# EAGLE design exp (EAGLE 5.06)
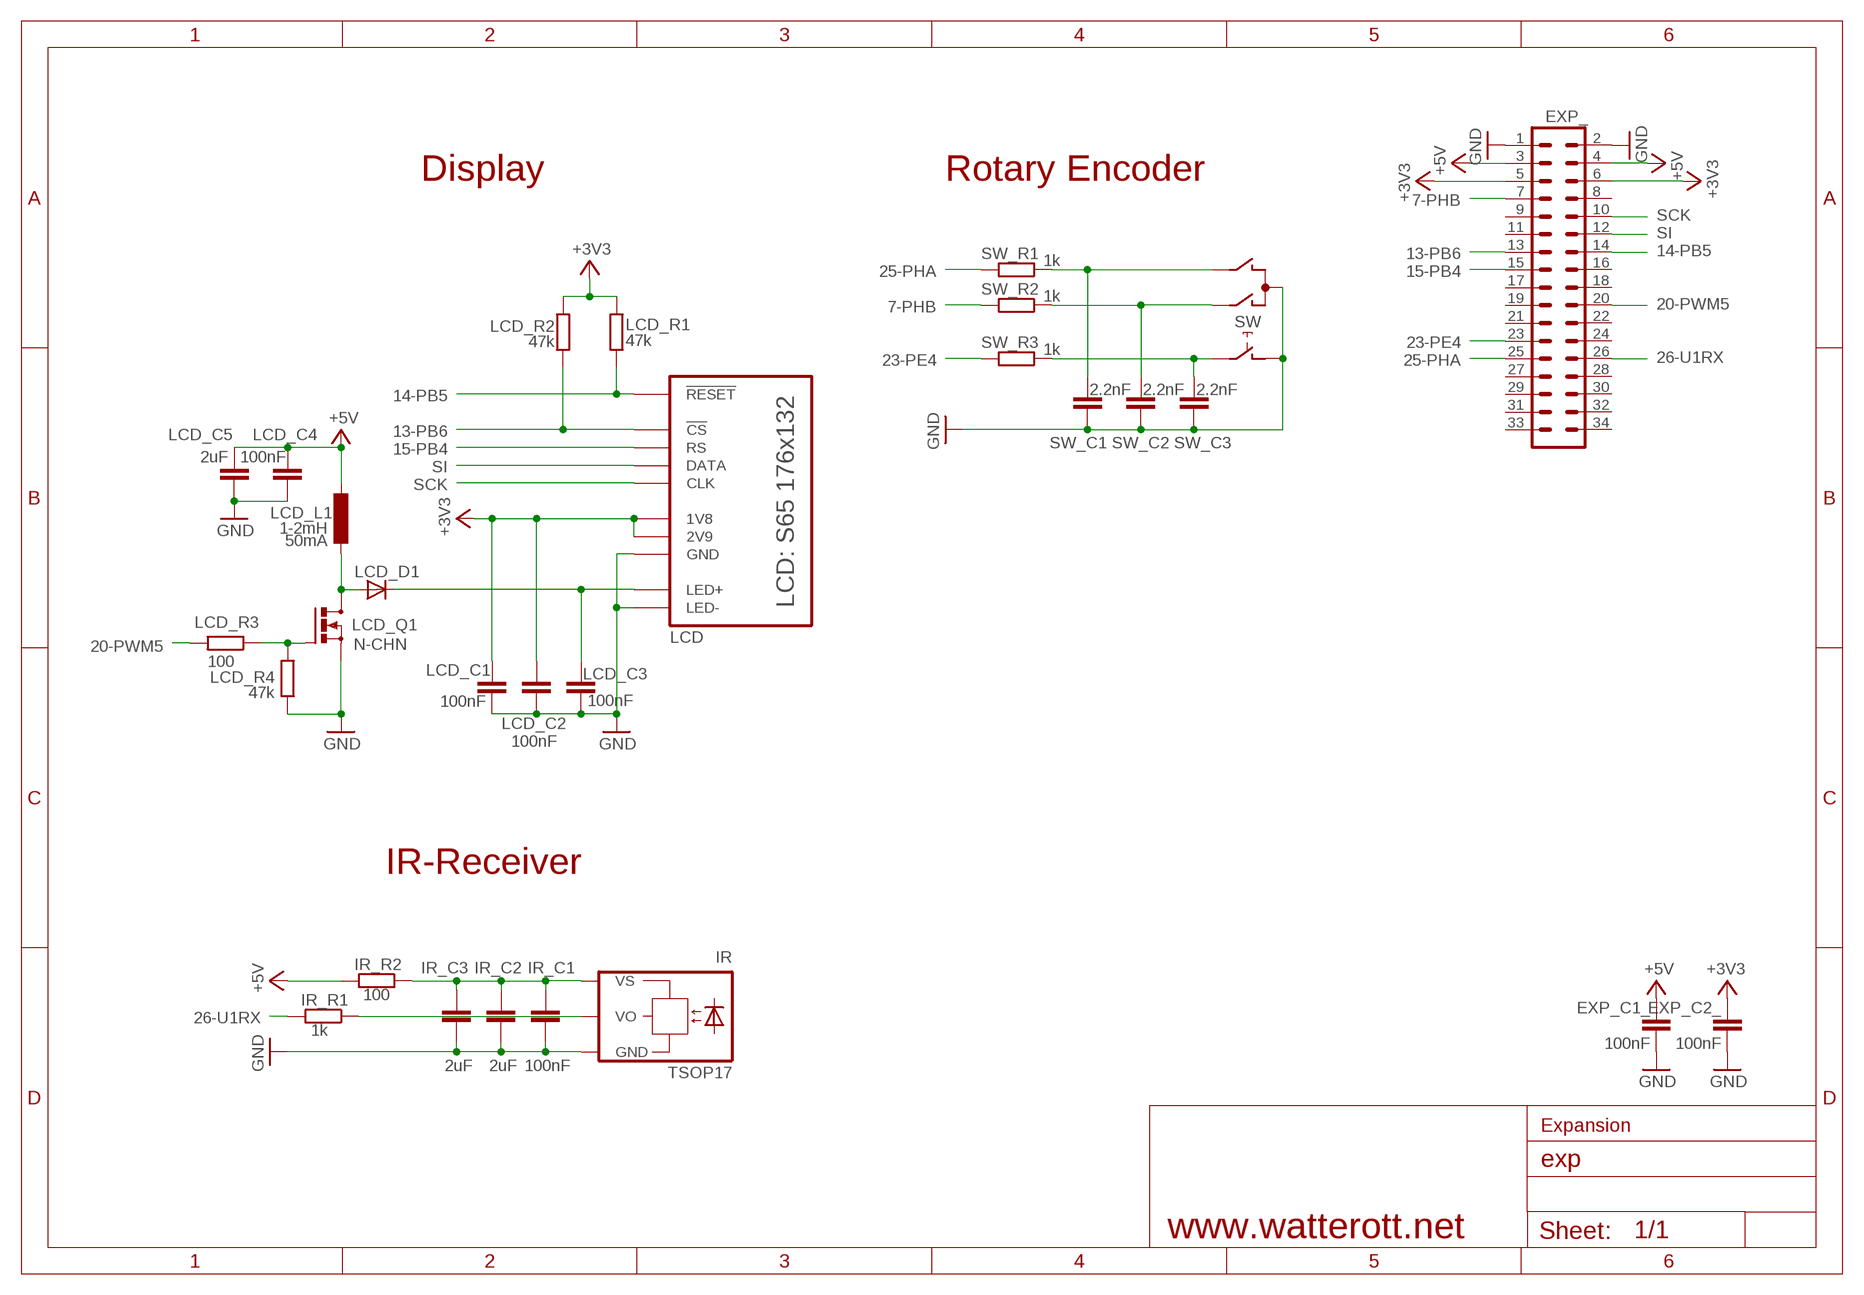
[diagram p0: schematic, sheet 1]

## Parts
EXP_  MA17-2  [MA17-2]
EXP_C1_  100nF  C-EUC0603  [C0603]
EXP_C2_  100nF  C-EUC0603  [C0603]
IR  TSOP17  [TSOP17]
IR_C1  100nF  C-EUC0603  [C0603]
IR_C2  2uF  C-EUC0603K  [C0603K]
IR_C3  2uF  C-EUC0603K  [C0603K]
IR_R1  1k  R-EU_R0603  [R0603]
IR_R2  100  R-EU_R0603  [R0603]
LCD  S65  [S65]
LCD_C1  100nF  C-EUC0603  [C0603]
LCD_C2  100nF  C-EUC0603  [C0603]
LCD_C3  100nF  C-EUC0603  [C0603]
LCD_C4  100nF  C-EUC0603  [C0603]
LCD_C5  2uF  C-EUC0603K  [C0603K]
LCD_D1  DIODE-DO214AA  [DO214AA]
LCD_L1  1-2mH  L-EUL4532C  [L4532M]
LCD_Q1  N-CHN  IRLML2502  [MICRO3]
LCD_R1  47k  R-EU_R0603  [R0603]
LCD_R2  47k  R-EU_R0603  [R0603]
LCD_R3  100  R-EU_R0603  [R0603]
LCD_R4  47k  R-EU_R0603  [R0603]
SW  EC12E_SW  [ALPS_EC12E_SW]
SW_C1  2.2nF  C-EUC0603  [C0603]
SW_C2  2.2nF  C-EUC0603  [C0603]
SW_C3  2.2nF  C-EUC0603  [C0603]
SW_R1  1k  R-EU_R0603  [R0603]
SW_R2  1k  R-EU_R0603  [R0603]
SW_R3  1k  R-EU_R0603  [R0603]

## Nets
7-PHB: EXP_.7 SW_R2.2
13-PB6: EXP_.13 LCD.CS(!CS) LCD_R2.2
14-PB5: EXP_.14 LCD.RESET(!RESET) LCD_R1.2
15-PB4: EXP_.15 LCD.RS
20-PWM5: EXP_.20 LCD_R3.2
23-PE4: EXP_.23 SW_R3.2
25-PHA: EXP_.25 SW_R1.2
26-U1RX: EXP_.26 IR_R1.2
+3V3: EXP_.5 EXP_.6 EXP_C2_.1 LCD.1V8 LCD.2V9 LCD_C1.1 LCD_C2.1 LCD_R1.1 LCD_R2.1
+5V: EXP_.3 EXP_.4 EXP_C1_.1 IR_R2.2 LCD_C4.1 LCD_C5.1 LCD_L1.2
B: LCD_Q1.1(G) LCD_R3.1 LCD_R4.2
E: LCD_D1.A LCD_L1.1 LCD_Q1.3(D)
GND: EXP_.1 EXP_.2 EXP_C1_.2 EXP_C2_.2 IR.GND IR_C1.2 IR_C2.2 IR_C3.2 LCD.GND LCD.LED- LCD_C1.2 LCD_C2.2 LCD_C3.2 LCD_C4.2 LCD_C5.2 LCD_Q1.2(S) LCD_R4.1 SW.C SW.D SW_C1.1 SW_C2.1 SW_C3.1
LED+: LCD.LED+ LCD_C3.1 LCD_D1.C
N$1: SW.B SW_C1.2 SW_R1.1
N$3: SW.A SW_C2.2 SW_R2.1
N$4: SW.E SW_C3.2 SW_R3.1
SCK: EXP_.10 LCD.CLK
SI: EXP_.12 LCD.DATA
VO: IR.VO IR_R1.1
VS: IR.VS IR_C1.1 IR_C2.1 IR_C3.1 IR_R2.1
Unconnected: EXP_.8 EXP_.9 EXP_.11 EXP_.16 EXP_.17 EXP_.18 EXP_.19 EXP_.21 EXP_.22 EXP_.24 EXP_.27 EXP_.28 EXP_.29 EXP_.30 EXP_.31 EXP_.32 EXP_.33 EXP_.34 SW.GND1(G) SW.GND2(G)

## Notes on the sheet
- Display | Rotary Encoder
- 50mA
- IR-Receiver
- Expansion
- www.watterott.net

## Library data of the parts
EXP_ = con-lstb:MA17-2: PIN HEADER
EXP_C1_ EXP_C2_ IR_C1-IR_C3 LCD_C1-LCD_C5 SW_C1-SW_C3 = rcl:C-EU: CAPACITOR, European symbol
IR = Encoder-IR:TSOP17
IR_R1 IR_R2 LCD_R1-LCD_R4 SW_R1-SW_R3 = rcl:R-EU_: RESISTOR, European symbol
LCD = Display:S65: Siemens S65 Display 176x132 16bit
LCD_D1 = diode:DIODE-: DIODE
LCD_L1 = rcl:L-EU: INDUCTOR, European symbol
LCD_Q1 = IRF-sot23:IRLML2502: N-Channel Power MOSFET
SW = Encoder-IR:EC12E_SW: ALPS EC12E Rotary Encoder with switch

## Board
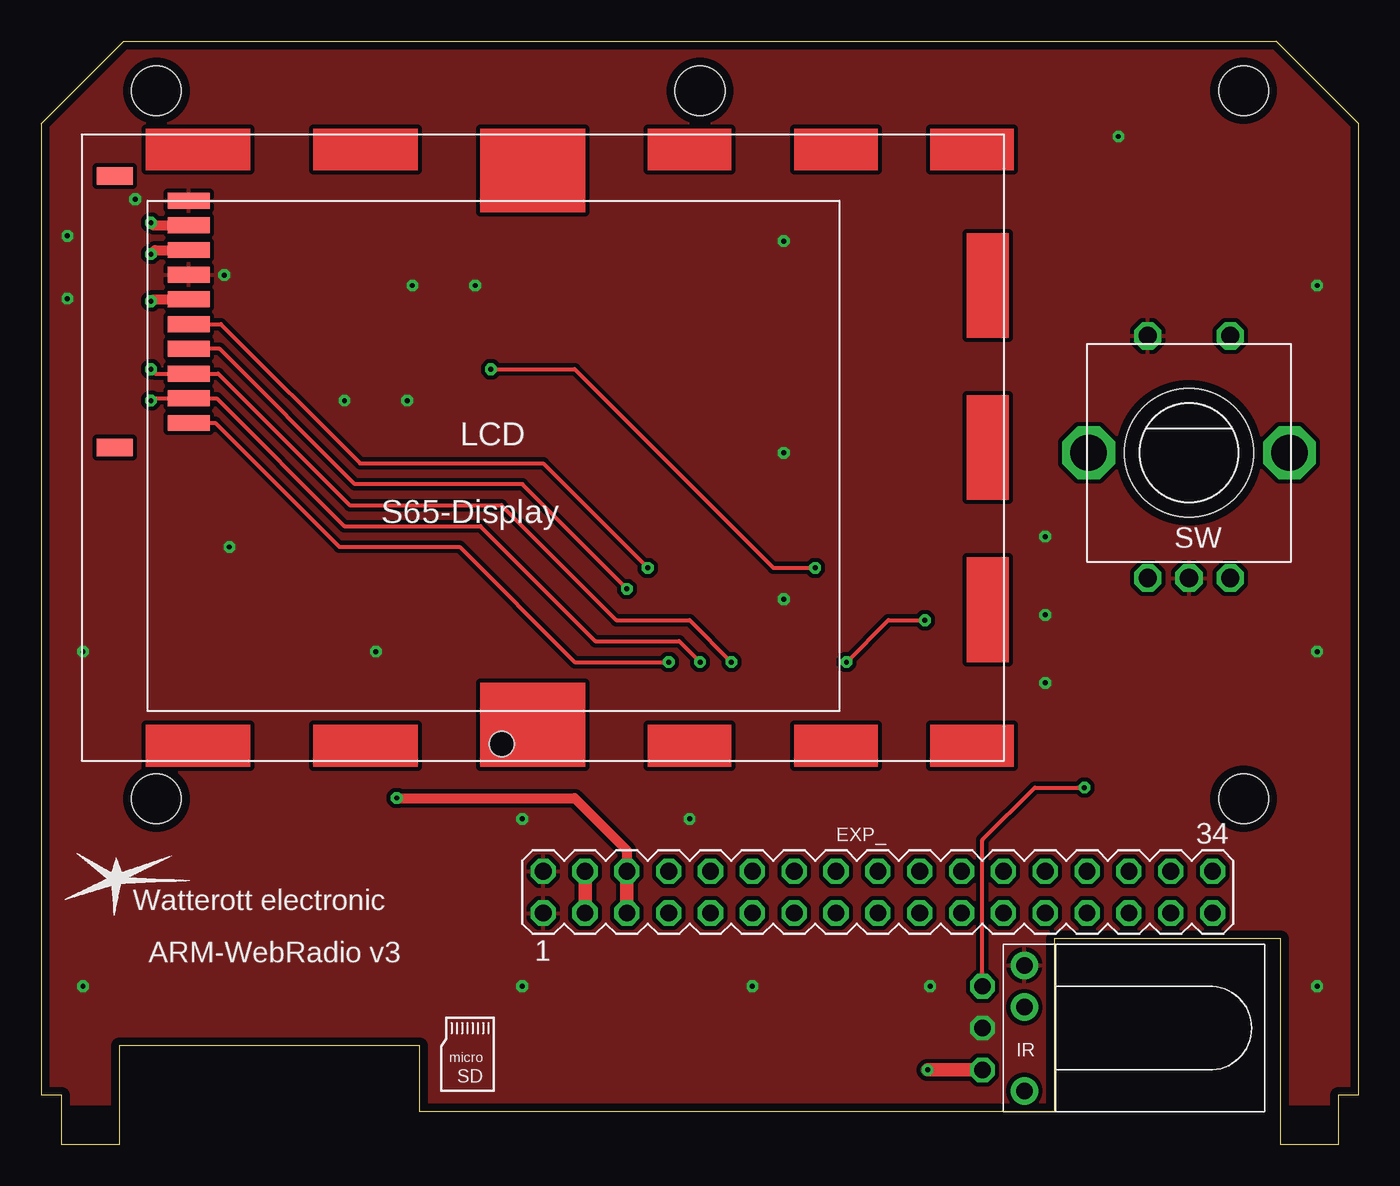
[diagram p1: board, top side]
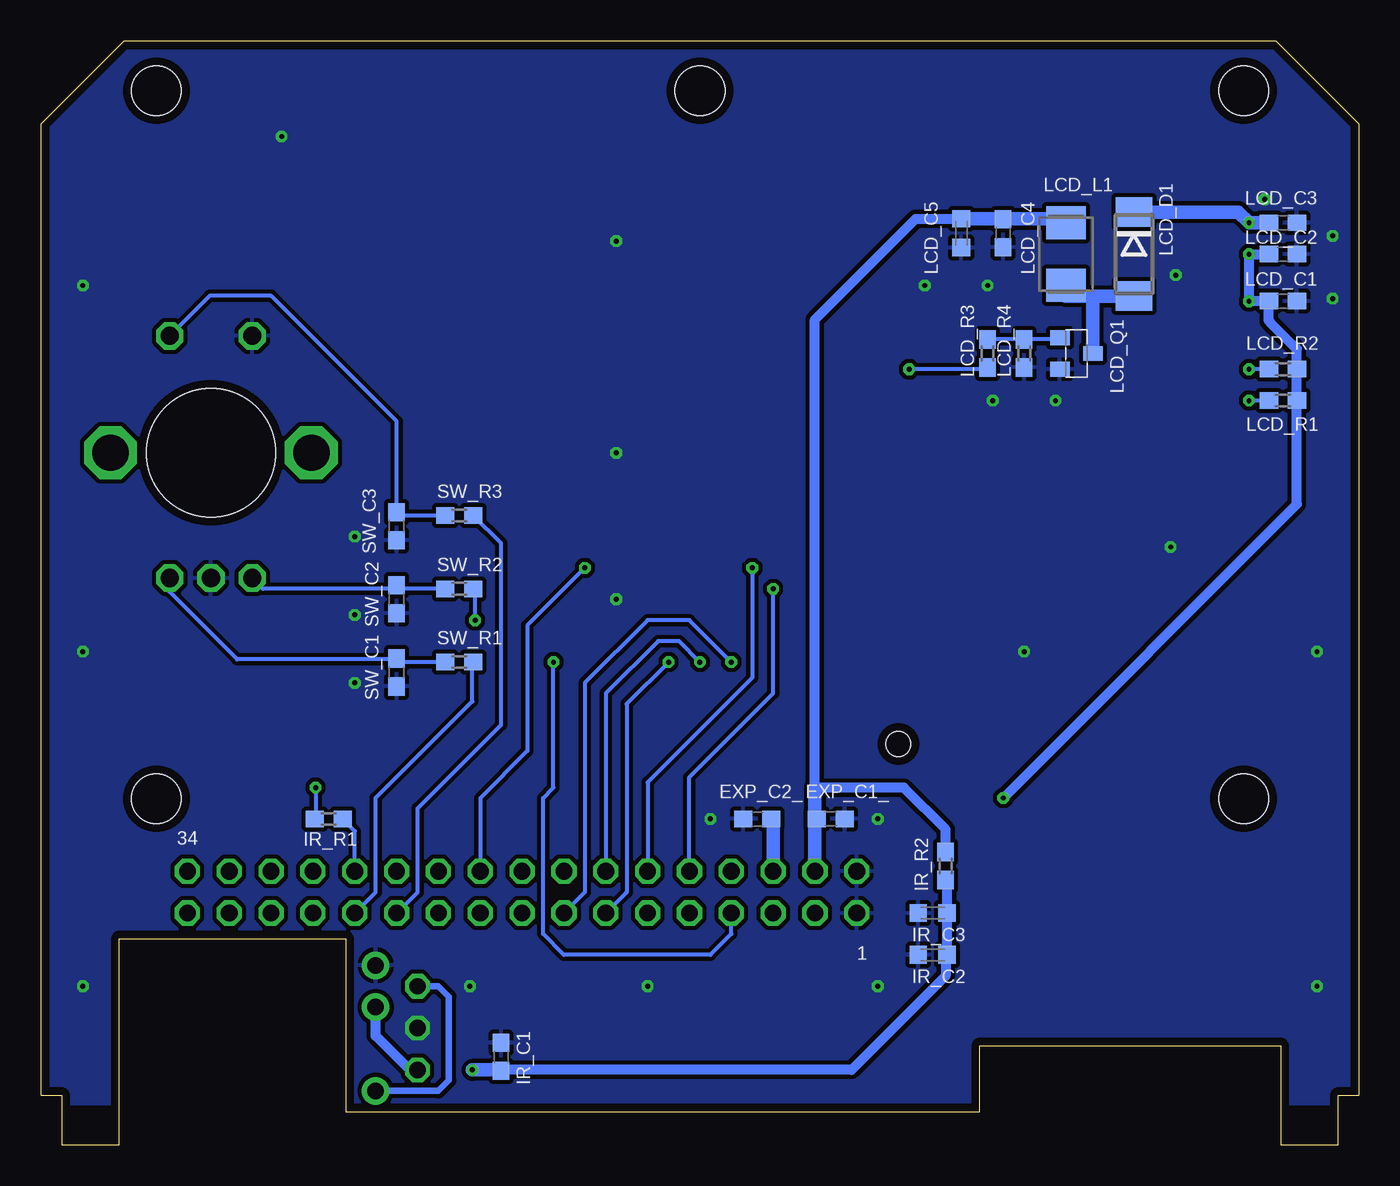
[diagram p2: board, bottom side, seen from below]

Size 80 x 67 mm. Coordinates in mm from the lower left corner, seen from the top.
Outline: 80,3 80,62 75,67 5,67 0,62 0,3 1.25,3 1.25,0 4.75,0 4.75,6 23,6 23,2 61.5,2 61.5,12.5 75.25,12.5 75.25,0 78.75,0 78.75,3 80,3
Copper layers (1*16): Top 0.035mm / dielectric 1.5mm / Bottom 0.035mm
Design rules "default *": minimum track width 7mil, minimum drill 0.3mm, track to track 7mil, track to pad 7mil, pad to pad 7mil, via to via 7mil, smd to smd 7mil, copper to edge 20mil, drill to drill 8mil, minimum pad ring 10mil, minimum via ring 8mil, stop-mask expansion 4mil, vias tented up to drill 0.5mm, thermal gap 10mil
Holes 3 mm at 7,64 40,64 7,21 73,64 73,21
Holes 7.8 mm at 69.69,42.01

### Footprints (pad centres in the part's own frame; a part is rotated, then mirrored left to right if it is on the bottom)
MA17-2 = drill 1.016 octagon: 1 -20.32,-1.27; 2 -20.32,1.27; 3 -17.78,-1.27; 4 -17.78,1.27; 5 -15.24,-1.27; 6 -15.24,1.27; 7 -12.7,-1.27; 8 -12.7,1.27; 9 -10.16,-1.27; 10 -10.16,1.27; 11 -7.62,-1.27; 12 -7.62,1.27; 13 -5.08,-1.27; 14 -5.08,1.27; 15 -2.54,-1.27; 16 -2.54,1.27; 17 0,-1.27; 18 0,1.27; 19 2.54,-1.27; 20 2.54,1.27; 21 5.08,-1.27; 22 5.08,1.27; 23 7.62,-1.27; 24 7.62,1.27; 25 10.16,-1.27; 26 10.16,1.27; 27 12.7,-1.27; 28 12.7,1.27; 29 15.24,-1.27; 30 15.24,1.27; 31 17.78,-1.27; 32 17.78,1.27; 33 20.32,-1.27; 34 20.32,1.27
C0603 = smd 1.1 x 1: 1 -0.85,0; 2 0.85,0
TSOP17 = drill 1 pad 1.676 round: GND 0,3.81; VO 0,-3.81; VS 0,1.27
C0603K = smd 1.05 x 1.08: 1 -0.875,0; 2 0.875,0
R0603 = smd 1.1 x 1: 1 -0.85,0; 2 0.85,0
S65 = smd 2.54 x 0.965: 1V8 6.5,31; 2V9 6.5,28; CLK 6.5,25; CS 6.5,23.5; DATA 6.5,26.5; GND 6.5,29.5; LED+ 6.5,32.5; LED- 6.5,34; RESET 6.5,22; RS 6.5,20.5 | smd 2.184 x 1.067: NC1 2,19; NC2 2,35.5 | hole 1.5: 25.5,1
DO214AA = smd 1.8 x 2.2: A 2.55,0; C -2.55,0
L4532M = smd 2 x 2.4: 1 -1.9,0; 2 1.9,0
MICRO3 = smd 0.9 x 1.2: 1 -0.95,-1; 2 0.95,-1; 3 0,1
ALPS_EC12E_SW = drill 1.1 octagon: A -2.5,-7.6; B 2.5,-7.6; C 0,-7.6; D -2.5,7.1; E 2.5,7.1 | drill 2.2 octagon: GND1 -6.1,0; GND2 6.1,0

### Placement (x,y rotation side)
EXP_  50.8,15.34 0 top
EXP_C1_  32.07,19.78 0 bottom
EXP_C2_  36.51,19.78 180 bottom
IR  59.69,7.08 0 top
IR_C1  52.07,5.33 90 bottom
IR_C2  25.88,11.53 180 bottom
IR_C3  25.88,14.06 180 bottom
IR_R1  62.55,19.78 0 bottom
IR_R2  25.08,16.92 90 bottom
LCD  2.46,23.32 0 top
LCD_C1  4.6,51.21 0 bottom
LCD_C2  4.6,54.07 0 bottom
LCD_C3  4.6,55.98 0 bottom
LCD_C4  21.59,55.34 270 bottom
LCD_C5  24.13,55.34 270 bottom
LCD_D1  13.65,54.07 270 bottom
LCD_L1  17.78,54.07 90 bottom
LCD_Q1  17.14,48.04 270 bottom
LCD_R1  4.6,45.18 180 bottom
LCD_R2  4.6,47.09 180 bottom
LCD_R3  22.54,48.04 270 bottom
LCD_R4  20.32,48.04 90 bottom
SW  69.69,42.01 0 top
SW_C1  58.42,28.67 90 bottom
SW_C2  58.42,33.11 90 bottom
SW_C3  58.42,37.56 90 bottom
SW_R1  54.61,29.3 0 bottom
SW_R2  54.61,33.75 0 bottom
SW_R3  54.61,38.2 0 bottom

### Tracks (layer width: path | path; a pad name or v marks a point on that pad's centre or on a via)
7-PHB  (via drill 0.3)
  Top 0.254: v48.9,29.3 51.44,31.84 v53.66,31.84
  Bottom 0.254: SW_R2.2 53.66,33.75 v53.66,31.84 | EXP_.7 38.1,12.79 39.37,11.53 48.26,11.53 49.53,12.79 49.53,21.05 48.9,21.68 v48.9,29.3
13-PB6  (via drill 0.3)
  Top 0.254: v6.67,47.09 6.93,46.82 LCD.CS 10.74,46.82 18.73,38.83 27.94,38.83 34.92,31.84 39.37,31.84 v41.91,29.3
  Bottom 0.254: LCD_R2.2 v6.67,47.09 | EXP_.13 | EXP_.13 44.45,15.34 44.45,26.77 v41.91,29.3
14-PB5  (via drill 0.3)
  Top 0.254: v6.67,45.18 6.81,45.32 LCD.RESET 10.65,45.32 18.41,37.56 26.67,37.56 33.66,30.57 38.73,30.57 v40.01,29.3
  Bottom 0.254: LCD_R1.2 v6.67,45.18 | EXP_.14 45.72,27.4 42.55,30.57 41.27,30.57 v40.01,29.3
15-PB4  (via drill 0.3)
  Top 0.254: LCD.RS 10.57,43.82 18.1,36.29 25.4,36.29 32.38,29.3 v38.1,29.3
  Bottom 0.254: EXP_.15 | EXP_.15 46.99,15.34 46.99,28.04 43.18,31.84 40.64,31.84 v38.1,29.3
20-PWM5  (via drill 0.3)
  Top 0.254: v27.3,47.09 32.38,47.09 44.45,35.02 v46.99,35.02
  Bottom 0.254: v27.3,47.09 22.64,47.09 LCD_R3.2 | v46.99,35.02 50.48,31.53 50.48,23.91 53.34,21.05 EXP_.20
23-PE4
  Bottom 0.254: SW_R3.2 52.07,36.51 52.07,25.5 57.15,20.41 57.15,15.34 EXP_.23
25-PHA
  Bottom 0.254: SW_R1.2 53.82,29.25 53.82,26.92 59.69,21.05 59.69,15.34 EXP_.25
26-U1RX
  Bottom 0.254: EXP_.26 60.96,19.04 IR_R1.2
+3V3  (via drill 0.3)
  Top 0.61: LCD.1V8 6.92,54.32 v6.67,54.07 | v21.59,21.05 32.38,21.05 35.56,17.88 EXP_.6 | LCD.2V9 6.78,51.32 v6.67,51.21
  Top 0.813: EXP_.6 EXP_.5
  Bottom 0.406: 35.56,19.68 EXP_C2_.1 | LCD_R1.1 | 5.4,49.94 5.45,50 5.4,49.94
  Bottom 0.61: LCD_C2.1 v6.67,54.07 v6.67,51.21 LCD_C1.1 5.45,50 | 5.4,49.94 3.75,48.3 LCD_R2.1 LCD_R1.1 3.75,38.89 v21.59,21.05
  Bottom 0.813: EXP_.6 35.56,19.68
+5V
  Top 0.813: EXP_.4 EXP_.3
  Bottom 0.406: 33.02,19.78 EXP_C1_.1 | 21.27,56.22 21.59,56.22 LCD_C4.1
  Bottom 0.61: IR_R2.2 25.08,19.14 27.62,21.68 33.02,21.68 33.02,50.1 26.91,56.22 LCD_C5.1 | 17.78,56.22 LCD_L1.2 | EXP_C1_.1 33.02,19.68
  Bottom 0.813: 33.02,21.68 33.02,19.78 | 17.78,56.22 21.27,56.22 LCD_C5.1 | 33.02,19.68 EXP_.4
B
  Bottom 0.254: LCD_R3.1 LCD_R4.2 18.14,48.89 LCD_Q1.1
E
  Bottom 0.813: 16.14,51.52 LCD_D1.A | LCD_Q1.3 16.14,51.52 | 16.14,51.52 17.78,51.52 LCD_L1.1
GND  (via drill 0.3, 1)
  other vias: 18.41,45.18 22.23,45.18 11.11,52.8 22.54,52.16 57.15,7.08 39.37,19.78 29.21,19.78 60.96,36.92 60.96,32.16 60.96,28.04 1.59,55.18 1.59,51.37 26.35,52.16 65.41,61.21 11.43,36.29 29.21,9.62 53.98,9.62 2.54,9.62 2.54,29.94 77.47,52.16 77.47,29.94 77.47,9.62 20.32,29.94 45.09,42.01 45.09,54.86 45.09,33.11 5.71,57.4 43.18,9.62
  pour Top (isolate 0.254, rank 2): 0.5,62 5,66.5 75,66.5 79.5,62 79.5,2.5 0.5,2.5
  pour Bottom (isolate 0.254): 0.5,62 5,66.5 75,66.5 79.5,62 79.5,2.5 0.5,2.5
LED+  (via drill 0.3)
  Top 0.61: LCD.LED+ 6.82,55.82 v6.67,55.98
  Bottom 0.813: LCD_C3.1 v6.67,55.98 7.31,56.62 LCD_D1.C
N$1
  Bottom 0.254: SW_R1.1 58.2,29.3 SW_C1.2 58.48,29.46 68.1,29.46 72.23,33.59 72.23,34.37 SW.B
N$3
  Bottom 0.254: SW_R2.1 58.2,33.75 SW_C2.2 58.63,33.75 66.54,33.75 SW.A
N$4
  Bottom 0.254: SW_R3.1 58.2,38.2 SW_C3.2 | SW_C3.2 58.42,43.91 66.04,51.53 69.77,51.53 SW.E | SW_C3.2
SCK  (via drill 0.3)
  Top 0.254: LCD.CLK 10.83,48.32 19.05,40.1 29.21,40.1 v35.56,33.75
  Bottom 0.254: EXP_.10 40.64,22.32 35.56,27.4 v35.56,33.75
SI  (via drill 0.3)
  Top 0.254: LCD.DATA 10.92,49.82 19.37,41.37 30.48,41.37 v36.83,35.02
  Bottom 0.254: EXP_.12 43.18,22 36.83,28.35 v36.83,35.02
VO  (via drill 0.3, 1)
  Top 0.254: v57.15,9.62 57.15,18.51 60.33,21.68 v63.34,21.68
  Bottom 0.254: v63.34,21.68 63.34,19.84 IR_R1.1
  Bottom 0.406: IR.VO 55.88,3.27 55.24,3.91 55.24,8.98 55.88,9.62 v57.15,9.62
VS  (via drill 0.3, 1)
  Top 0.813: v53.82,4.54 v57.15,4.54
  Bottom 0.406: IR_C2.1 25.08,11.53
  Bottom 0.61: v57.15,4.54 57.63,4.54 59.69,6.6 IR.VS | IR_R2.1 25,16.07 IR_C3.1 IR_C2.1 | 25.08,11.53 25.08,10.26 30.8,4.54 52.07,4.54 IR_C1.1
  Bottom 0.813: 52.07,4.54 v53.82,4.54
(copper drawn outside any net)
  shapes: Top area x15

### Text on the board
tPlace: S65-Display | Watterott electronic | micro | SD
bPlace: 34 | 1
tNames: ARM-WebRadio v3